# EAGLE design OHS (EAGLE 9.1.2)
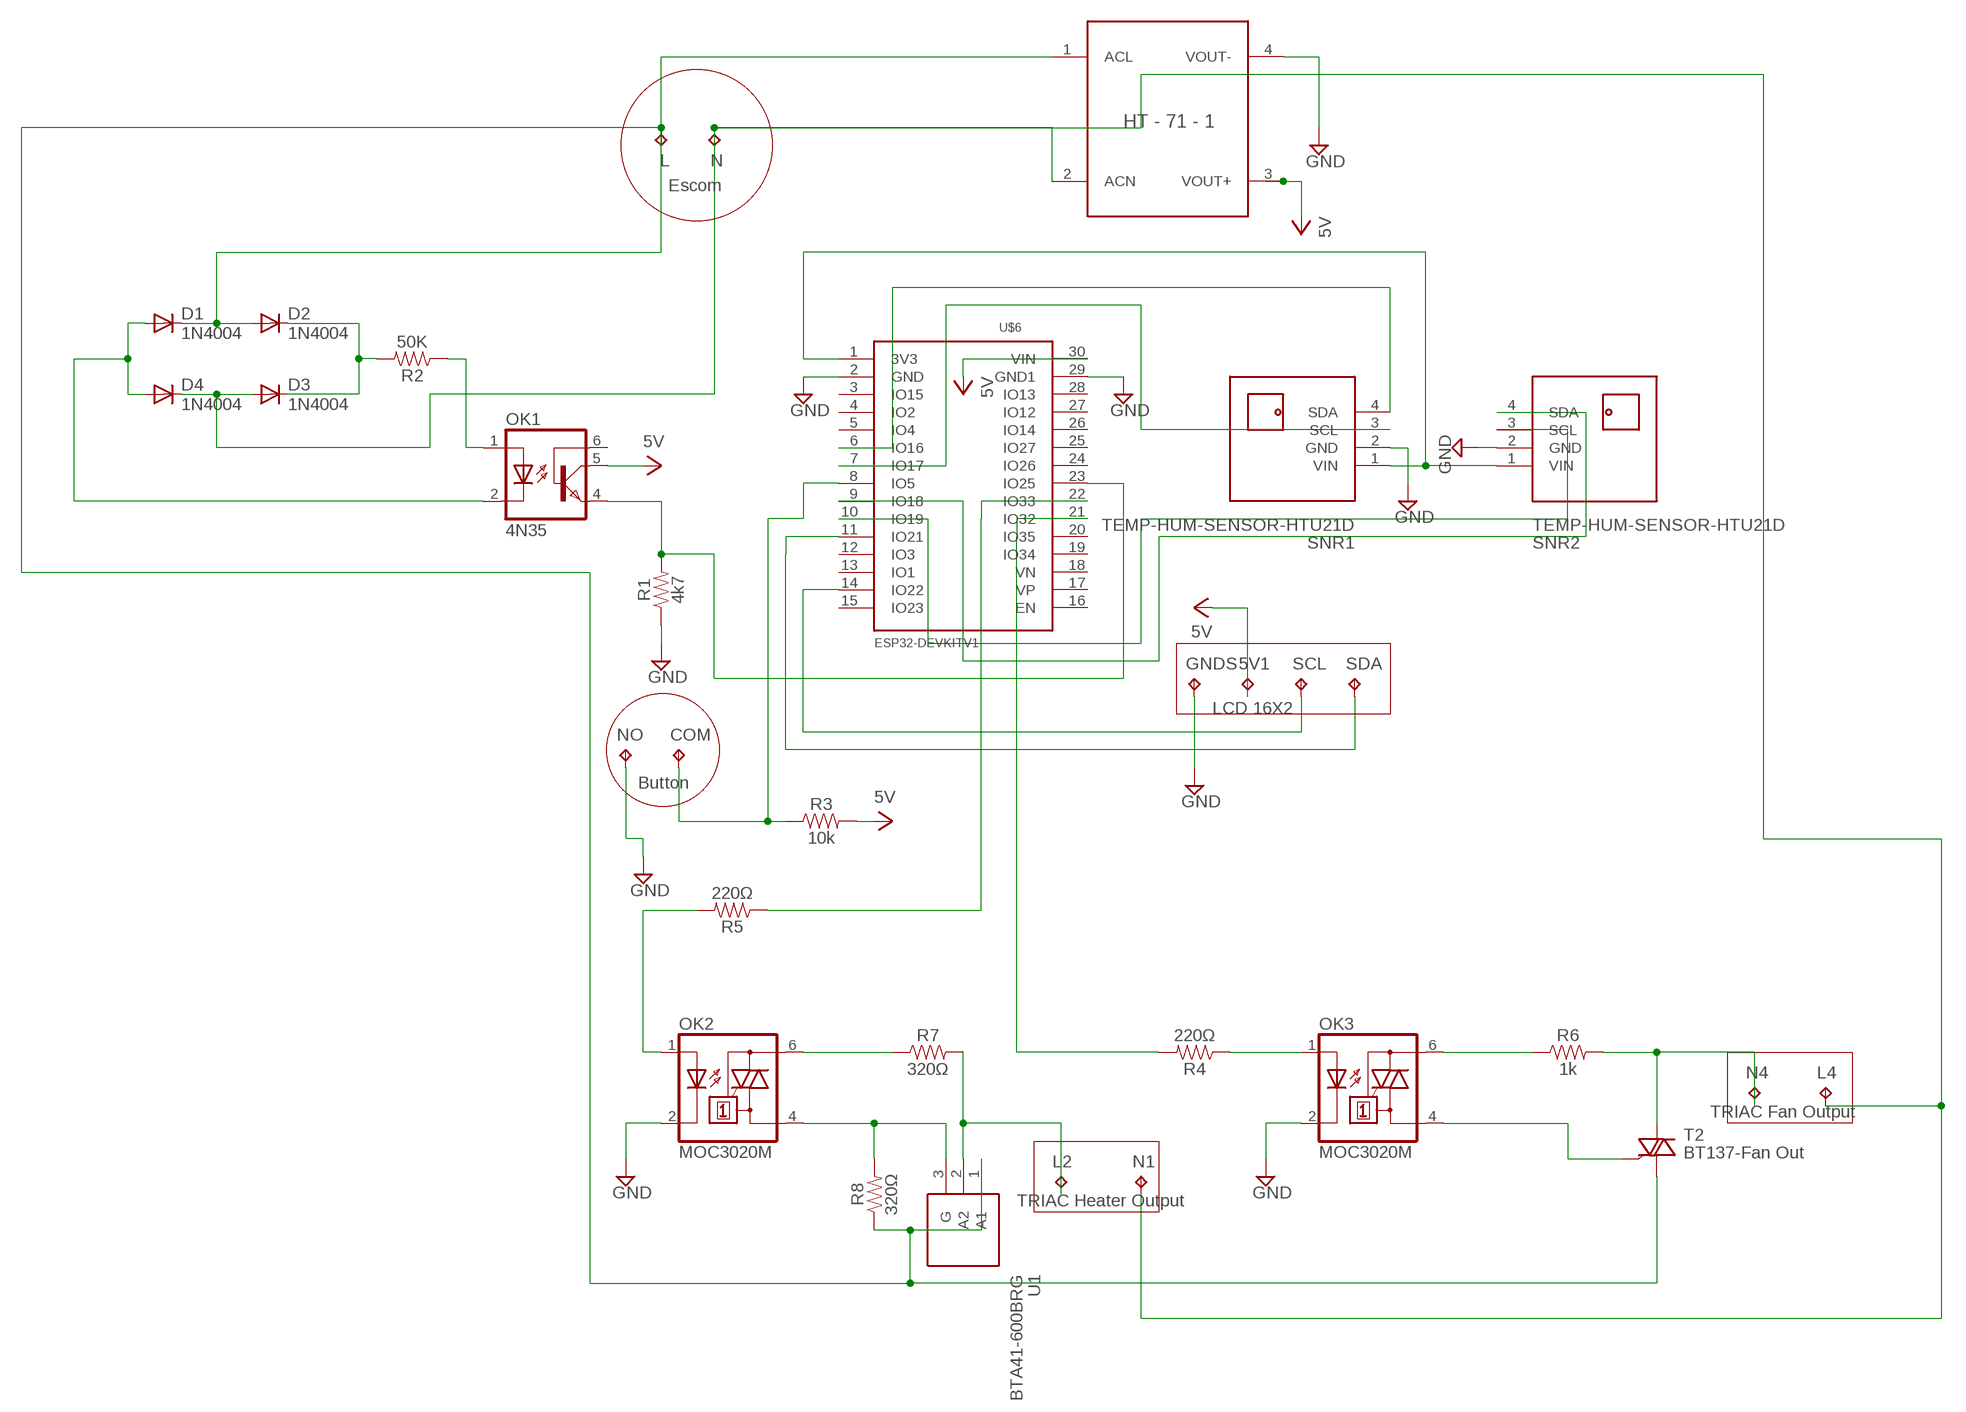
[diagram p0: schematic, sheet 1]

## Parts
5V1  TPPAD1-20Y  [P1-20Y]
COM  TPPAD1-20Y  [P1-20Y]
D1  1N4004  [DO41-10]
D2  1N4004  [DO41-10]
D3  1N4004  [DO41-10]
D4  1N4004  [DO41-10]
GNDS  TPPAD1-20Y  [P1-20Y]
L  TPPAD1-20Y  [P1-20Y]
L2  TPPAD1-20Y  [P1-20Y]
L4  TPPAD1-20Y  [P1-20Y]
N  TPPAD1-20Y  [P1-20Y]
N1  TPPAD1-20Y  [P1-20Y]
N4  TPPAD1-20Y  [P1-20Y]
NO  TPPAD1-20Y  [P1-20Y]
OK1  4N35  [DIL06]
OK2  MOC3020M  [DIL06]
OK3  MOC3020M  [DIL06]
R1  4k7  10KOHM-HORIZ-1/4W-5%  [AXIAL-0.3]
R2  50K  10KOHM-HORIZ-1/4W-5%  [AXIAL-0.3]
R3  10k  10KOHM-HORIZ-1/4W-5%  [AXIAL-0.3]
R4  220Ω  1KOHM-HORIZ-1/4W-5%  [AXIAL-0.3]
R5  220Ω  1KOHM-HORIZ-1/4W-5%  [AXIAL-0.3]
R6  1k  1KOHM-HORIZ-1/4W-5%  [AXIAL-0.3]
R7  320Ω  1KOHM-HORIZ-1/4W-5%  [AXIAL-0.3]
R8  320Ω  1KOHM-HORIZ-1/4W-5%  [AXIAL-0.3]
SCL  TPPAD1-20Y  [P1-20Y]
SDA  TPPAD1-20Y  [P1-20Y]
SNR1  TEMP-HUM-SENSOR-HTU21D  [TEMP-HUM-SENSOR-HTU21D]
SNR2  TEMP-HUM-SENSOR-HTU21D  [TEMP-HUM-SENSOR-HTU21D]
T2  BT137-Fan Out  BT138-V  [TO220BV]
U1  BTA41-600BRG  [TO552P460X1530X2985-3P]
U$1  AD-DC-240-5  [HT-71-1]
U$6  ESP32DEVKITV1  [ESP32-DEVKITV1]

## Nets
GND: GNDS.TP NO.TP OK2.2(C) OK3.2(C) R1.P$1 SNR1.2(GND) SNR2.2(GND) U$1.4(VOUT-) U$6.2(GND) U$6.29(GND1)
N$1: OK3.6(A2) R6.P$1
N$2: SNR2.3(SCL) U$6.10(IO19)
N$3: SNR2.4(SDA) U$6.9(IO18)
N$4: SNR1.3(SCL) U$6.7(IO17)
N$5: OK2.6(A2) R7.P$1
N$6 [ESCOM]: D3.A D4.C L4.TP N1.TP N.TP U$1.2(ACN)
N$7 [ESCOM]: D1.C D2.A L.TP R8.P$1 T2.T1(A1) U1.1(A1) U$1.1(ACL)
N$8: D2.C D3.C R2.P$2
N$9: SNR1.4(SDA) U$6.6(IO16)
N$10 [ESCOM mid]: N4.TP R6.P$2 T2.T2(A2)
N$11: D1.A D4.A OK1.2(C)
N$12: SNR1.1(VIN) SNR2.1(VIN) U$6.1(3V3)
N$13: OK1.1(A) R2.P$1
N$14: OK3.4(A1) T2.G
N$15 [ESCOM mid]: OK2.4(A1) R8.P$2 U1.3(G)
N$16: OK1.4(EMI) R1.P$2 U$6.23(IO25)
N$17: COM.TP R3.P$1 U$6.8(IO5)
N$18: L2.TP R7.P$2 U1.2(A2)
N$19: SDA.TP U$6.11(IO21)
N$20: R5.P$1 U$6.22(IO33)
N$21: R4.P$2 U$6.21(IO32)
N$22: SCL.TP U$6.14(IO22)
N$23: OK2.1(A) R5.P$2
N$24: OK3.1(A) R4.P$1
VCC: 5V1.TP OK1.5(COL) R3.P$2 U$1.3(VOUT+) U$6.30(VIN) ; supply symbol labelled 5V
Unconnected: OK1.6(BAS) U$6.3(IO15) U$6.4(IO2) U$6.5(IO4) U$6.12(IO3) U$6.13(IO1) U$6.15(IO23) U$6.16(EN) U$6.17(VP) U$6.18(VN) U$6.19(IO34) U$6.20(IO35) U$6.24(IO26) U$6.25(IO27) U$6.26(IO14) U$6.27(IO12) U$6.28(IO13)

## Notes on the sheet
- Escom
- LCD 16X2
- Button
- TRIAC Fan Output
- TRIAC Heater Output

## Library data of the parts
5V1 COM GNDS L L2 L4 N N1 N4 NO SCL SDA = testpad:TP: Test pad
D1-D4 = adafruit:1N4004: DIODE General purpose 1N400x type rectifier (With bigger pads) http://www.ladyada.net/library/pcb/eaglelibrary.html
OK1 = optocoupler:4N35: MOTOROLA OPTO COUPLER; MF: FAIRCHILD SEMICONDUCTOR; MPN: 4N35; OC_FARNELL: 1328375; OC_NEWARK: 72K9946
OK2 OK3 = optocoupler:MOC30*M: RANDOM-PHASE OPTOISOLATORS TRIAC DRIVER OUTPUT Source: http://www.fairchildsemi.com MOC3020-M.pdf; MF: FAIRCHILD SEMICONDUCTOR; MPN: MOC3020-M; OC_FARNELL: 1505425; OC_NEWARK: 72K8895
R1 R2 = SparkFun-Resistors:10KOHM: 10kΩ resistor A resistor is a passive two-terminal electrical component that implements electrical resistance as a circuit element. Resistors act to reduce current flow, and, at the same time, act to lower voltage levels within circuits. - Wikipedia; PROD_ID: RES-09435; VALUE: 10k
R3 = SparkFun-Resistors:10KOHM: 10kΩ resistor A resistor is a passive two-terminal electrical component that implements electrical resistance as a circuit element. Resistors act to reduce current flow, and, at the same time, act to lower voltage levels within circuits. - Wikipedia; PROD_ID: RES-09435
R4 R5 R7 R8 = SparkFun-Resistors:1KOHM: 1kΩ resistor A resistor is a passive two-terminal electrical component that implements electrical resistance as a circuit element. Resistors act to reduce current flow, and, at the same time, act to lower voltage levels within circuits. - Wikipedia; PROD_ID: RES-08380; VALUE: 1k
R6 = SparkFun-Resistors:1KOHM: 1kΩ resistor A resistor is a passive two-terminal electrical component that implements electrical resistance as a circuit element. Resistors act to reduce current flow, and, at the same time, act to lower voltage levels within circuits. - Wikipedia; PROD_ID: RES-08380
SNR1 SNR2 = GHIdiy-modules:TEMP-HUM-SENSOR-HTU21D: Digital Humidity & Temperature Sensor based on HTU21D device More information about HTU21D device is available here: http://futureeverything.org/wp-content/uploads/2014/05/Humidity-Datasheet.pdf HTU21D Arudino Library is available here: https://learn.sparkfun.com/tutorials/htu21d-humidity-sensor-hookup-guide/htu21d-library-and-functions Click here to find device on ebay.com <http://www.ebay.com/sch/htu21d+board>
T2 = triac:BT138: TRIAC Source: http://www.semiconductors.philips.com BT138_SERIES_2.pdf
U1 = BTA41-600BRG:BTA41-600BRG: TRIAC BTA41-600BRG, 600V, Gate Trigger 1.3V 100mA, TOP Insulated 3-Pin Source: Datasheet <http://www.st.com/web/en/resource/technical/document/datasheet/CD00002263.pdf>; ALLIED_NUMBER: 70332160; ALLIED_PRICE-STOCK: http://www.alliedelec.com/stmicroelectronics-bta41-600brg/70332160/; DESCRIPTION: TRIAC BTA41-600BRG, 600V, Gate Trigger 1.3V 100mA, TOP Insulated 3-Pin; HEIGHT: 4.6mm; MANUFACTURER_NAME: STMicroelectronics; MANUFACTURER_PART_NUMBER: BTA41-600BRG; MOUSER_PART_NUMBER: 511-BTA41-600B; MOUSER_PRICE-STOCK: https://www.mouser.co.uk/ProductDetail/STMicroelectronics/BTA41-600BRG?qs=CkbNAJEAr%2FQw0ISg%252BSlP2w%3D%3D; RS_PART_NUMBER: 6871007P; RS_PRICE-STOCK: http://uk.rs-online.com/web/p/products/6871007P
U$1 = GHII Samsung AC DC:AD-DC-240-5
U$6 = ESP32-DEVKITV1Correct:ESP32DEVKITV1

## Net classes
0 default: width 0.762 mm, drill 0.762 mm, clearance 0.635 mm
1 ESCOM: width 2.5 mm, drill 2.5 mm, clearance 0.991 mm
2 ESCOM mid: width 2 mm, drill 2 mm, clearance 0.889 mm

## Board
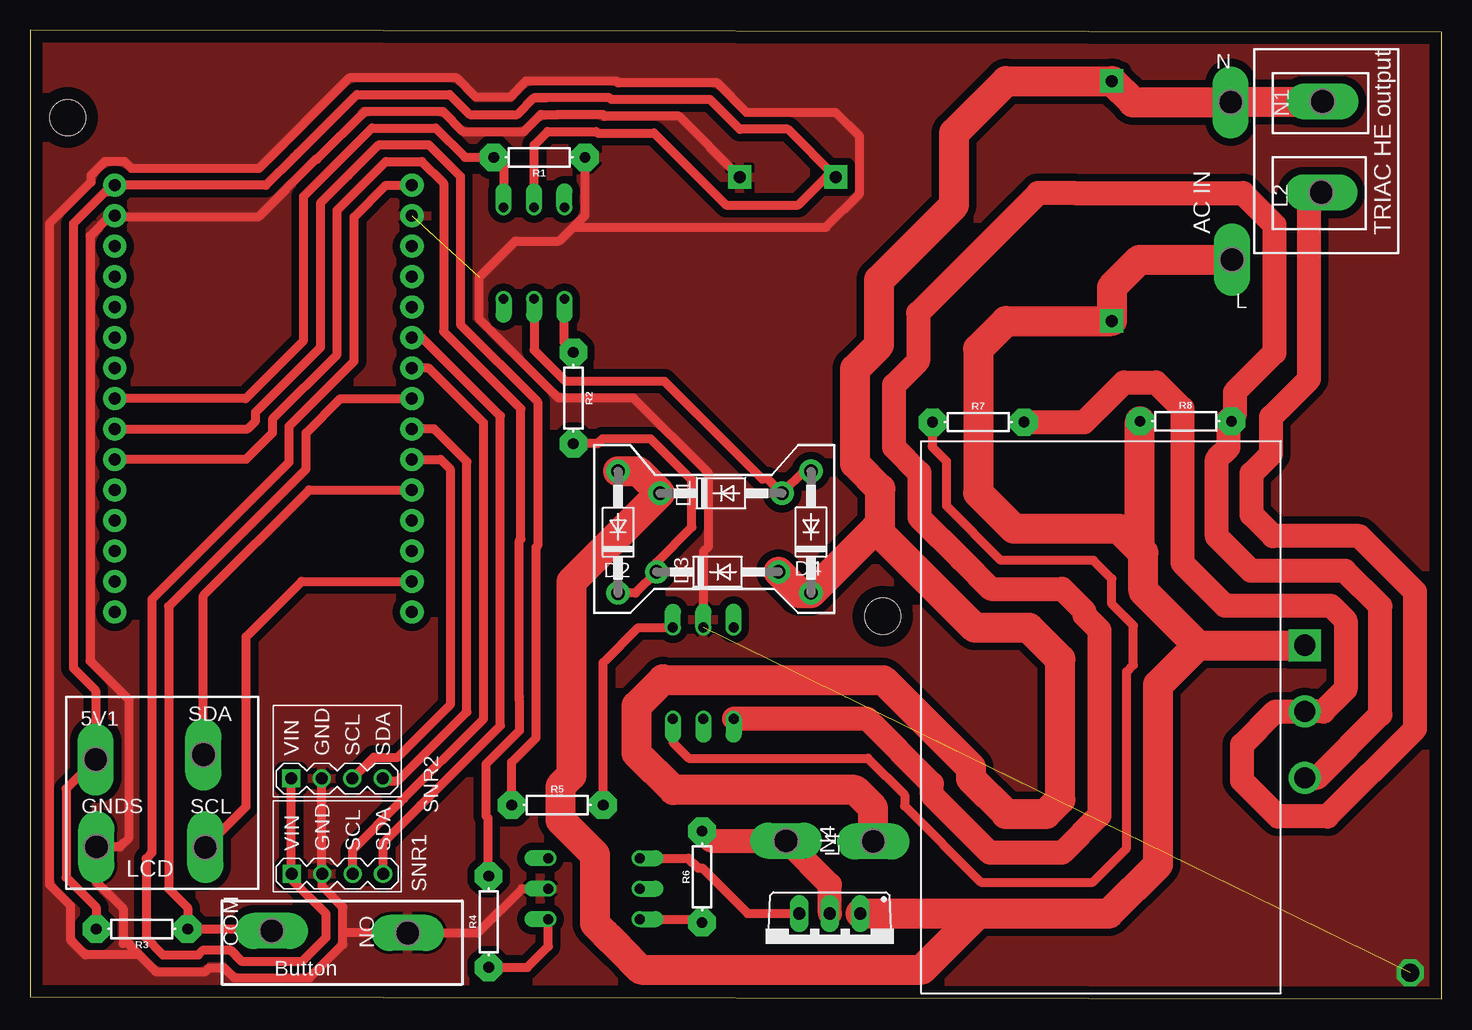
[diagram p1: board, top side]
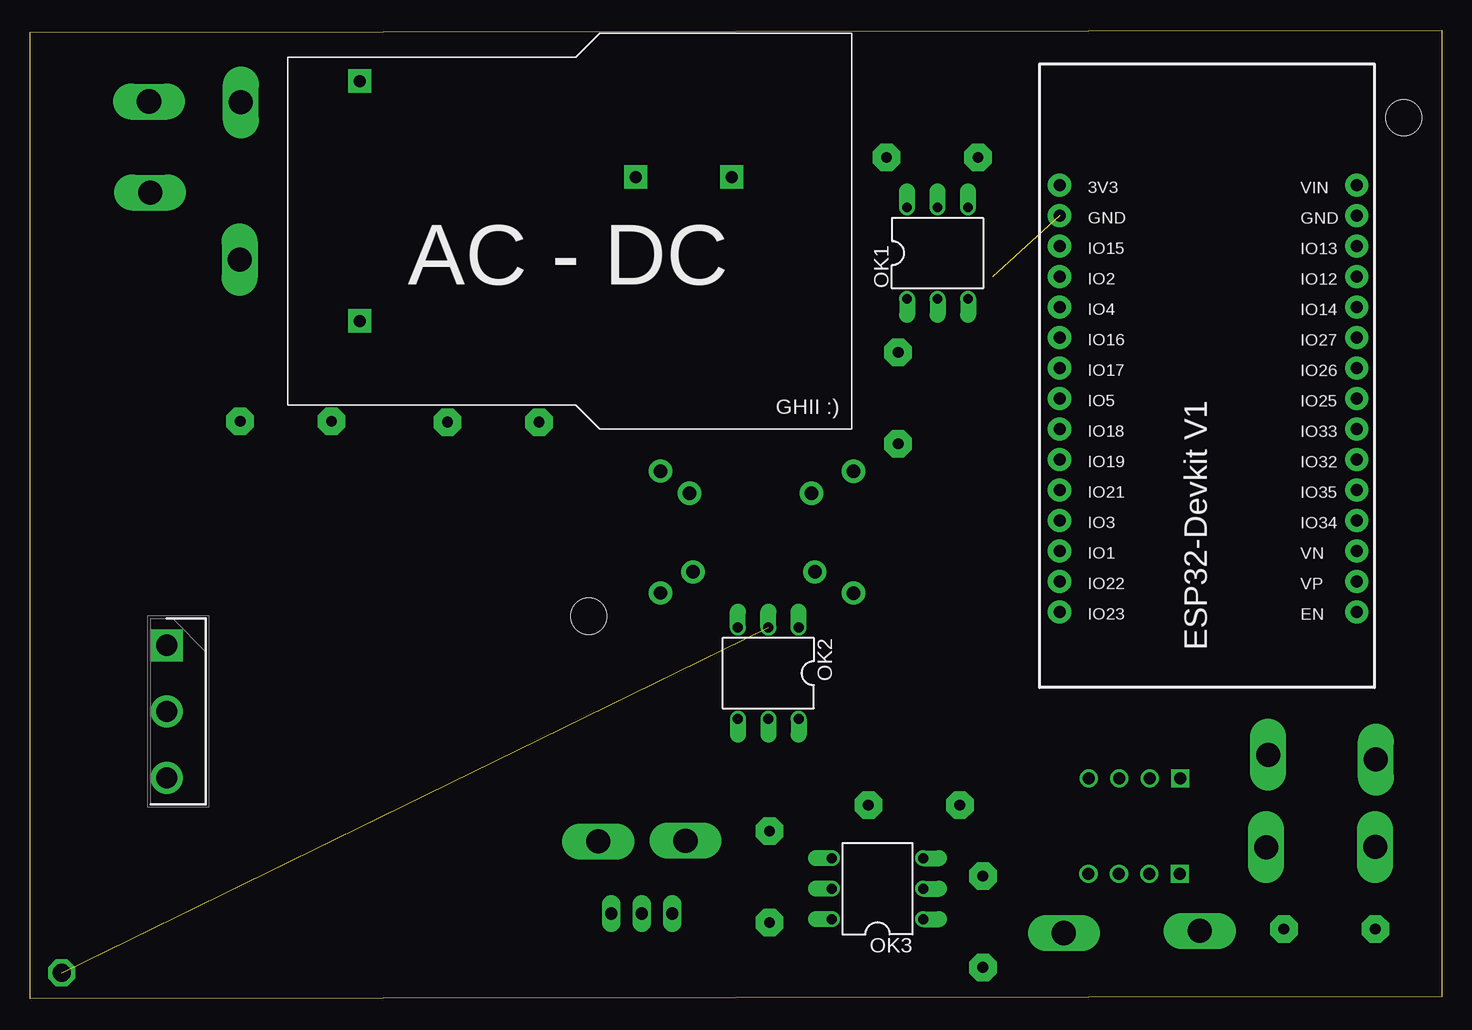
[diagram p2: board, bottom side, seen from below]

Size 117.63 x 80.79 mm. Coordinates in mm from the lower left corner, seen from the top.
Outline: 0,0.19 117.63,0 117.63,80.6 0,80.79 0,0.19
Copper layers (1*16): Top 0.035mm / dielectric 1.5mm / Bottom 0.035mm
Design rules "default": minimum track width 6mil, minimum drill 0.35mm, track to track 6mil, track to pad 6mil, pad to pad 6mil, via to via 6mil, smd to smd 6mil, copper to edge 40mil, drill to drill 6mil, minimum pad ring 10mil, minimum via ring 8mil, stop-mask expansion 4mil, vias tented up to drill 0mil, thermal gap 10mil
Holes 3 mm at 3.14,73.48 71.07,31.92

### Footprints (pad centres in the part's own frame; a part is rotated, then mirrored left to right if it is on the bottom)
P1-20Y = drill 2.007 pad 2.54 long: TP 0,0
DO41-10 = drill 1.118 pad 1.93: A 5.08,0; C -5.08,0
DIL06 = drill 0.813 offset: 1 -2.54,-3.81; 2 0,-3.81; 3 2.54,-3.81; 4 2.54,3.81; 5 0,3.81; 6 -2.54,3.81
AXIAL-0.3 = drill 0.9 pad 2.286 octagon: P$1 -3.81,0; P$2 3.81,0
TEMP-HUM-SENSOR-HTU21D = drill 1 square: 1 -5.08,3.81 | drill 1: 2 -5.08,1.27; 3 -5.08,-1.27; 4 -5.08,-3.81
TO220BV = drill 1.016 long: G 2.54,-2.54; T1 -2.54,-2.54; T2 0,-2.54
TO552P460X1530X2985-3P = drill 1.77 pad 2.655 square: 1 0,0 | drill 1.77 pad 2.655: 2 5.525,0; 3 11.05,0
HT-71-1 = drill 1 pad 1.93 square: 1 -8,-10; 2 -8,10; 3 15,2; 4 23,2
ESP32-DEVKITV1 = drill 1 pad 1.93: 1 -22.87,-13.54; 2 -20.33,-13.54; 3 -17.79,-13.54; 4 -15.25,-13.54; 5 -12.71,-13.54; 6 -10.17,-13.54; 7 -7.63,-13.54; 8 -5.09,-13.54; 9 -2.55,-13.54; 10 -0.01,-13.54; 11 2.53,-13.54; 12 5.07,-13.54; 13 7.61,-13.54; 14 10.15,-13.54; 15 12.69,-13.54; 16 12.69,11.23; 17 10.15,11.23; 18 7.61,11.23; 19 5.07,11.23; 20 2.53,11.23; 21 -0.01,11.23; 22 -2.55,11.23; 23 -5.09,11.23; 24 -7.63,11.23; 25 -10.17,11.23; 26 -12.71,11.23; 27 -15.25,11.23; 28 -17.79,11.23; 29 -20.33,11.23; 30 -22.87,11.23

### Placement (x,y rotation side)
5V1  5.47,19.97 0 top
COM  20.15,5.68 90 top
D1  57.58,42.17 0 top
D2  49,38.92 90 top
D3  57.3,35.61 0 top
D4  65.08,38.93 90 top
GNDS  5.54,12.68 0 top
L  100.16,61.64 180 top
L2  107.62,67.24 90 top
L4  70.27,13.14 90 top
N  100.06,74.76 0 top
N1  107.71,74.83 90 top
N4  63,13.19 270 top
NO  31.47,5.5 90 top
OK1  42,62.19 0 bottom
OK2  56.11,27.16 180 bottom
OK3  47,9.19 90 bottom
R1  42.44,70.17 180 top
R2  45.28,50.1 270 top
R3  9.33,5.83 180 top
R4  38.22,6.44 90 top
R5  43.95,16.17 0 top
R6  56,10.19 90 top
R7  79.02,48.1 0 top
R8  96.31,48.17 0 top
SCL  14.62,12.65 0 top
SDA  14.45,20.37 0 top
SNR1  25.61,15.52 90 top
SNR2  25.58,23.46 90 top
T2  66.65,4.59 180 top
U1  106.23,29.49 270 bottom
U$1  82.15,66.53 0 bottom
U$6  18.29,44.97 270 bottom

### Tracks (layer width: path | path; a pad name or v marks a point on that pad's centre or on a via)
GND  (via drill 1.5 pad 1.1)  (2 unrouted)
  Top 0.762: 7.76,5.08 7.76,7.55 5.54,9.77 GNDS.TP 7.49,12.68 8.22,13.41 8.22,24.97 5,28.19 5,63.62 6.69,65.3 U$6.29 7.17,65.19 19,65.19 23.81,70 23.91,70 27.92,74.01 34.39,74.01 36.07,72.33 41.17,72.33 42.56,73.73 44,73.73 47.73,73.73 47.87,73.59 54.1,73.59 U$1.4 | 7.76,5.08 7.76,4.64 | SNR2.2 24.31,10.47 SNR1.2 24.34,9.39 26.07,7.66 26.07,5.48 | 7.76,5.08 8.27,4.57 8.27,4.5 10.29,2.48 | 10.29,2.48 10.5,2.28 14.61,2.28 14.93,2.6 16.18,2.6 17.02,1.76 23.28,1.76 26.07,4.55 26.07,5.48 | 26.07,5.48 26.09,5.5 NO.TP 37.31,5.5 41,9.19 OK3.2 | 45.25,64.34 46.25,65.34 R1.P$1 | OK2.2 56.11,37.3 56.55,37.74 56.55,43.84 50.29,50.1 44.04,50.1 37.44,56.7 37.44,60.19 40.44,63.19 44.1,63.19 45.25,64.34 | 10.29,2.48 9.1,3.68 4.62,3.68 3.36,4.94 3.36,7.81 1.62,9.55 1.62,64.64 5.08,68.1 5.08,68.66 6.24,69.82 7.88,69.82 8.46,69.24 19.05,69.24 26.62,76.81 35.54,76.81 37.16,75.19 40,75.19 41.33,76.52 48.88,76.52 49.02,76.38 57.26,76.38 59.73,73.91 67.14,73.91 69.14,71.92 69.14,67.15 66.33,64.34 45.25,64.34
  other vias: 115,2.19
  pour Top: -5,-0.81 -5,84.19 121,84.19 121,-2.81 -5,-2.81
N$1
  Top 0.762: OK3.6 55.73,6.65 R6.P$1
N$2
  Top 0.762: SNR2.3 26.89,18.38 28.66,20.15 30.64,20.15 35,24.51 35,44.19 34.21,44.98 U$6.10
N$3
  Top 0.762: SNR2.4 29.58,18.19 30.65,18.19 36.4,23.93 36.4,44.79 33.67,47.52 U$6.9
N$4
  Top 0.762: 30.82,16.37 26.88,12.44 SNR1.3 | 30.82,16.37 31.16,16.72 | 30.82,16.37 37.79,23.35 37.79,48.04 33.23,52.6 U$6.7
N$5
  Top 0.762: OK2.6 53.57,21.41 54.91,20.07 69.83,20.07 72.89,17.01 72.89,16.09 79.23,9.75 88.56,9.75 91.38,12.57 91.38,27.28 91.95,27.85 91.95,31.14 90.16,32.93 90.16,35.03 88.62,36.57 80.91,36.57 76.38,41.1 76.38,44.81 75.19,46 75.19,46.19 75.21,46.21 R7.P$1
N$6
  Top 2.5: N1.TP 100.13,74.83 N.TP 91.93,74.76 U$1.2 81.34,76.53 77,72.19 77,66.19 70.76,59.95 70.76,54.53 68.76,52.53 68.76,44.64 70.87,42.53 70.87,38.82 | L4.TP 70.27,15.92 68.77,17.42 53.63,17.42 50.56,20.5 50.56,24.45 52.76,26.65 52.81,26.59 71.1,26.59 78.4,19.29 78.4,18.37 81.34,15.43 84.66,15.43 85.87,16.64 85.87,28.32 83.24,30.95 78.74,30.95 70.87,38.82 | D3.A 64.14,33.85 D4.C 70.43,39.19 70.5,39.19 70.87,38.82
N$7
  Top 2.5: 97.3,29.49 94,26.19 94,11.19 89.94,7.13 79,7.13 | 97.3,29.49 U1.1 | 97.3,29.49 92.78,34.01 92.78,37.19 92.5,37.47 | 92.5,37.47 R8.P$1 | L.TP 92.45,61.64 90.16,59.34 U$1.1 81.34,56.53 79,54.19 79,42.19 82,39.19 90.78,39.19 92.5,37.47 | 49.08,4.27 50.9,2.46 74.33,2.46 79,7.13 | 49.08,4.27 47.91,5.45 | D2.A 50.67,44 D1.C 45.12,34.78 45.12,18.64 44.2,17.73 44.2,14.92 47.07,12.06 47.07,6.29 49.08,4.27 | T2.T1 79,7.13
N$8
  Top 0.762: D2.C 50.45,33.84 D3.C 52.22,36.41 55.15,39.34 55.15,43.26 51.71,46.71 47.69,46.71 47.28,46.29 R2.P$2
N$9
  Top 0.762: SNR1.4 29.42,13 32.3,15.89 | 32.3,15.89 32.56,16.14 | U$6.6 32.67,55.14 39.19,48.61 39.19,22.77 32.3,15.89
N$10
  Top 2: T2.T2 66.65,9.54 N4.TP 56.81,13.19 R6.P$2
N$11
  Top 0.762: D4.A 64.51,44.01 D1.A 61.49,43.34 61.02,43.34 52.87,51.5 44.62,51.5 42,54.11 OK1.2
N$12
  Top 0.762: SNR2.1 21.77,10.47 SNR1.1 21.8,9.95 24.67,7.08 24.67,5.12 22.7,3.15 17.6,3.15 16.67,4.08 14.44,4.08 14.03,3.68 11.08,3.68 9.67,5.08 9.67,11.71 10.15,12.19 10.15,33.32 21.6,44.77 21.6,47.77 27,53.17 27,65.19 29.65,67.84 U$6.1
N$13
  Top 0.762: R2.P$1 44.54,54.65 OK1.1
N$14
  Top 0.762: OK3.4 54.86,11.73 55.67,10.92 56,10.92 59.79,7.13 T2.G
N$15  (1 unrouted)
  Top 2: U1.3 107.25,18.44 112.53,23.72 112.53,32.75 109.58,35.7 101.76,35.7 98.91,38.55 98.91,45.01 99.89,45.99 99.89,48.28 100.12,48.5 | R8.P$2 100.12,48.5 | 77.6,36.68 74.11,40.16 74.11,43.87 72,45.98 72,51.19 74,53.19 74,57.19 84,67.19 87,67.19 101.06,67.19 103.7,64.56 103.7,53.89 100.4,50.59 100.4,48.79 100.12,48.5 | 77.6,36.68 | 77.6,36.68 80.08,34.19 86,34.19 87.89,32.3 87.89,31.99 89.11,30.77 89.11,15.3 86,12.19 80,12.19 75.16,17.03 75.16,17.95 69.75,23.35 OK2.4
N$16
  Top 0.762: U$6.23 17.97,50.06 22.81,54.9 22.81,66.93 28.5,72.61 33.81,72.61 36.25,70.17 R1.P$2 39.46,69.35 OK1.4
N$17
  Top 0.762: U$6.8 25.87,50.06 23,47.19 23,44.19 11.55,32.74 11.55,9.2 13.14,7.61 R3.P$1 | 13.53,5.45 R3.P$1 | R3.P$1 19.99,5.83 COM.TP
N$18
  Top 2: L2.TP 106.59,66.21 106.59,51.69 103.43,48.54 103.43,45.45 101.8,43.82 101.8,40.39 103.6,38.59 110.78,38.59 115.42,33.95 115.42,22.52 108.12,15.22 104.03,15.22 104,15.19 101,18.19 101,21.19 103.78,23.97 U1.2 107.78,23.97 109.64,25.83 109.64,31.55 108.39,32.81 99.57,32.81 96.02,36.35 96.02,49.23 93.84,51.41 91.16,51.41 87.84,48.1 R7.P$2
N$19
  Top 0.762: SDA.TP 14.45,33.64 23.25,42.44 U$6.11
N$20
  Top 0.762: 26.6,68.74 26.52,68.67 | 26.52,68.67 24.21,66.35 24.21,54.32 18.81,48.93 18.81,48.19 18.14,47.52 U$6.22 | 42.17,25.43 42.17,26.19 | 42.17,26.19 42.17,37.65 42.29,37.77 42.29,49.8 35.86,56.23 35.86,68.59 33.23,71.22 29.08,71.22 26.52,68.67 | 40.58,16.61 R5.P$1 40.14,19.75 42.17,21.78 42.17,26.19 | 42.17,26.19
N$21
  Top 0.762: 34.45,55.67 34.46,55.65 | 34.46,55.65 40.9,49.22 40.9,38.35 40.78,38.23 40.78,25.19 40.78,24.85 40.78,22.36 37.98,19.56 37.98,15.28 38.16,15.1 38.16,10.19 R4.P$2 | U$6.21 18,44.98 20.21,47.19 20.21,48.35 25.6,53.74 25.6,65.77 29.66,69.82 32.65,69.82 34.46,68.01 34.46,55.65
N$22
  Top 0.762: SCL.TP 18,16.04 18,30.19 22.63,34.82 U$6.14
N$23
  Top 0.762: R5.P$2 47.76,28.04 50.7,30.97 OK2.1
N$24
  Top 0.762: R4.P$1 41.44,2.63 43.19,4.38 OK3.1
VCC
  Top 0.762: R3.P$2 5.52,7.63 3.02,10.13 3.02,17.52 5V1.TP 5.47,25.72 3.61,27.58 3.61,64.65 6.24,67.28 6.5,67.28 U$6.30 19.65,67.84 22,70.19 | OK1.5 42,71.19 43.14,72.33 47.15,72.33 47.29,72.19 52,72.19 58,66.19 64,66.19 66.34,68.53 U$1.3 63.17,72.52 59.15,72.52 56.68,74.98 48.45,74.98 48.3,75.12 43,75.12 | 43,75.12 42.04,75.12 | 22.41,70.6 22,70.19 | 22,70.19 22.02,70.19 27.24,75.41 34.97,75.41 36.65,73.73 40.59,73.73 41.98,75.12 43,75.12

### Text on the board
tNames: AC IN | TRIAC HE output | LCD | Button